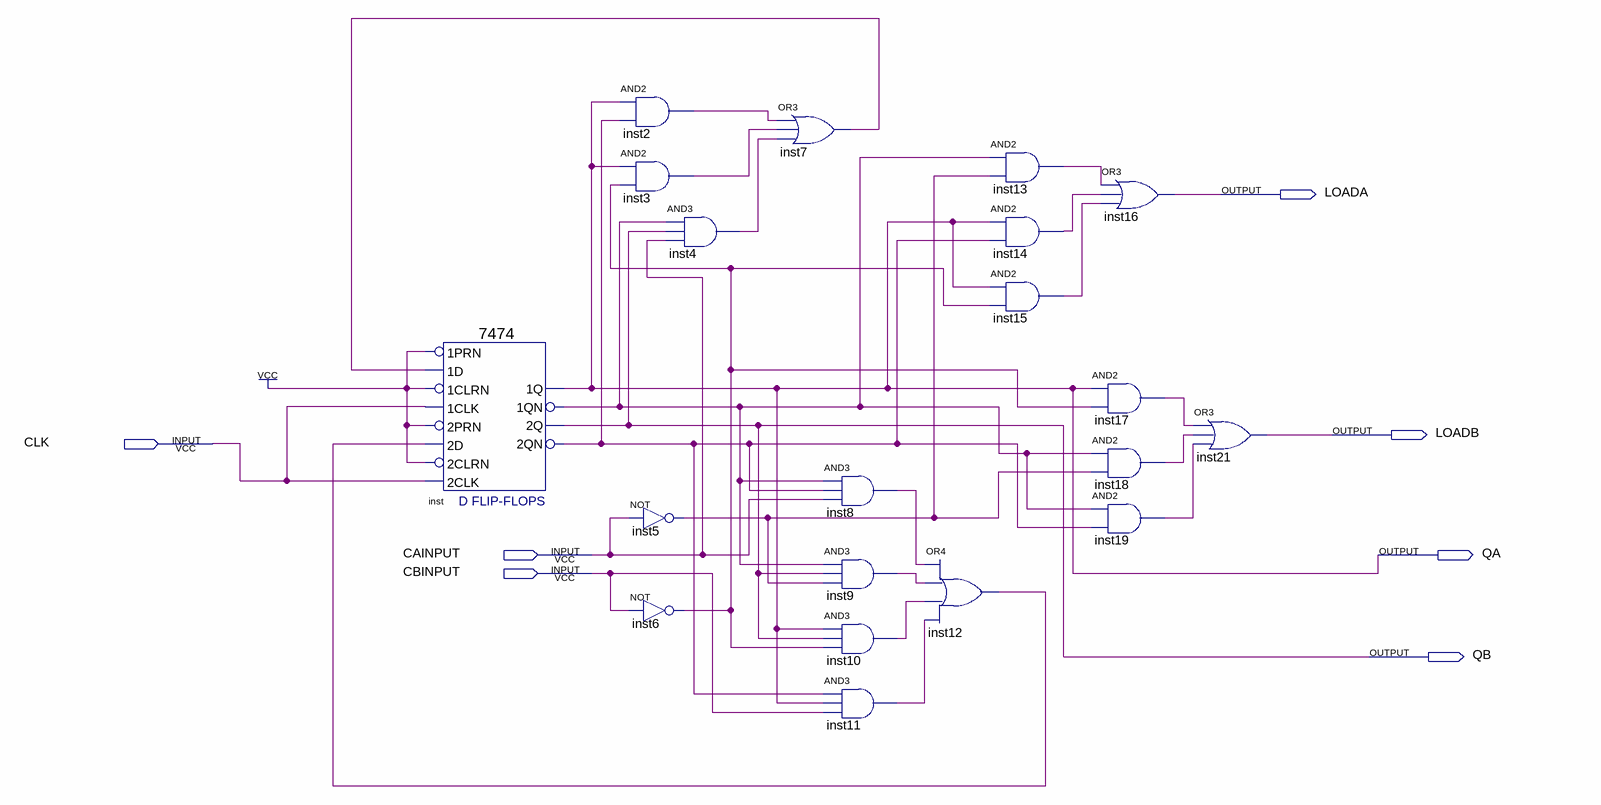
[diagram p0: schematic sheet]
// Quartus schematic CONTROL.bdf as structural Verilog: 20 symbols, 7 pins
module CONTROL (
  input  CLK,
  input  CAINPUT,
  input  CBINPUT,
  output LOADA,
  output LOADB,
  output QA,
  output QB
);

  wire inst2_out, inst3_out, inst4_out, inst5_out, inst6_out, inst7_out, inst8_out, inst9_out, inst10_out,
       inst11_out, inst12_out, inst13_out, inst14_out, inst15_out, inst17_out, inst18_out, inst19_out,
       inst_1qn, inst_2qn;

  \7474  inst (
    .\2D (inst12_out), .\2PRN (1'b1), .\1CLK (CLK), .\1D (inst7_out), .\1PRN (1'b1), .\2CLK (CLK),
    .\2CLRN (1'b1), .\1CLRN (1'b1), .\1QN (inst_1qn), .\2Q (QB), .\2QN (inst_2qn), .\1Q (QA));
  and inst2 (inst2_out, QA, inst_2qn);
  and inst3 (inst3_out, QA, inst6_out);
  and inst4 (inst4_out, inst_1qn, QB, CAINPUT);
  not inst5 (inst5_out, CAINPUT);
  not inst6 (inst6_out, CBINPUT);
  or inst7 (inst7_out, inst2_out, inst3_out, inst4_out);
  and inst8 (inst8_out, inst_1qn, inst_2qn, CAINPUT);
  and inst9 (inst9_out, inst_1qn, QB, inst5_out);
  and inst10 (inst10_out, QA, QB, inst6_out);
  and inst11 (inst11_out, inst_2qn, QA, CBINPUT);
  and inst13 (inst13_out, inst_1qn, inst5_out);
  and inst14 (inst14_out, QA, inst_2qn);
  and inst15 (inst15_out, QA, inst6_out);
  or inst12 (inst12_out, inst8_out, inst9_out, inst10_out, inst11_out);
  or inst16 (LOADA, inst13_out, inst14_out, inst15_out);
  and inst17 (inst17_out, QA, inst6_out);
  and inst18 (inst18_out, inst_1qn, inst5_out);
  and inst19 (inst19_out, inst_1qn, inst_2qn);
  or inst21 (LOADB, inst17_out, inst18_out, inst19_out);
endmodule
